# Altium schematic sheet MCUSTM32F4ZGT6.SchDoc
size A3
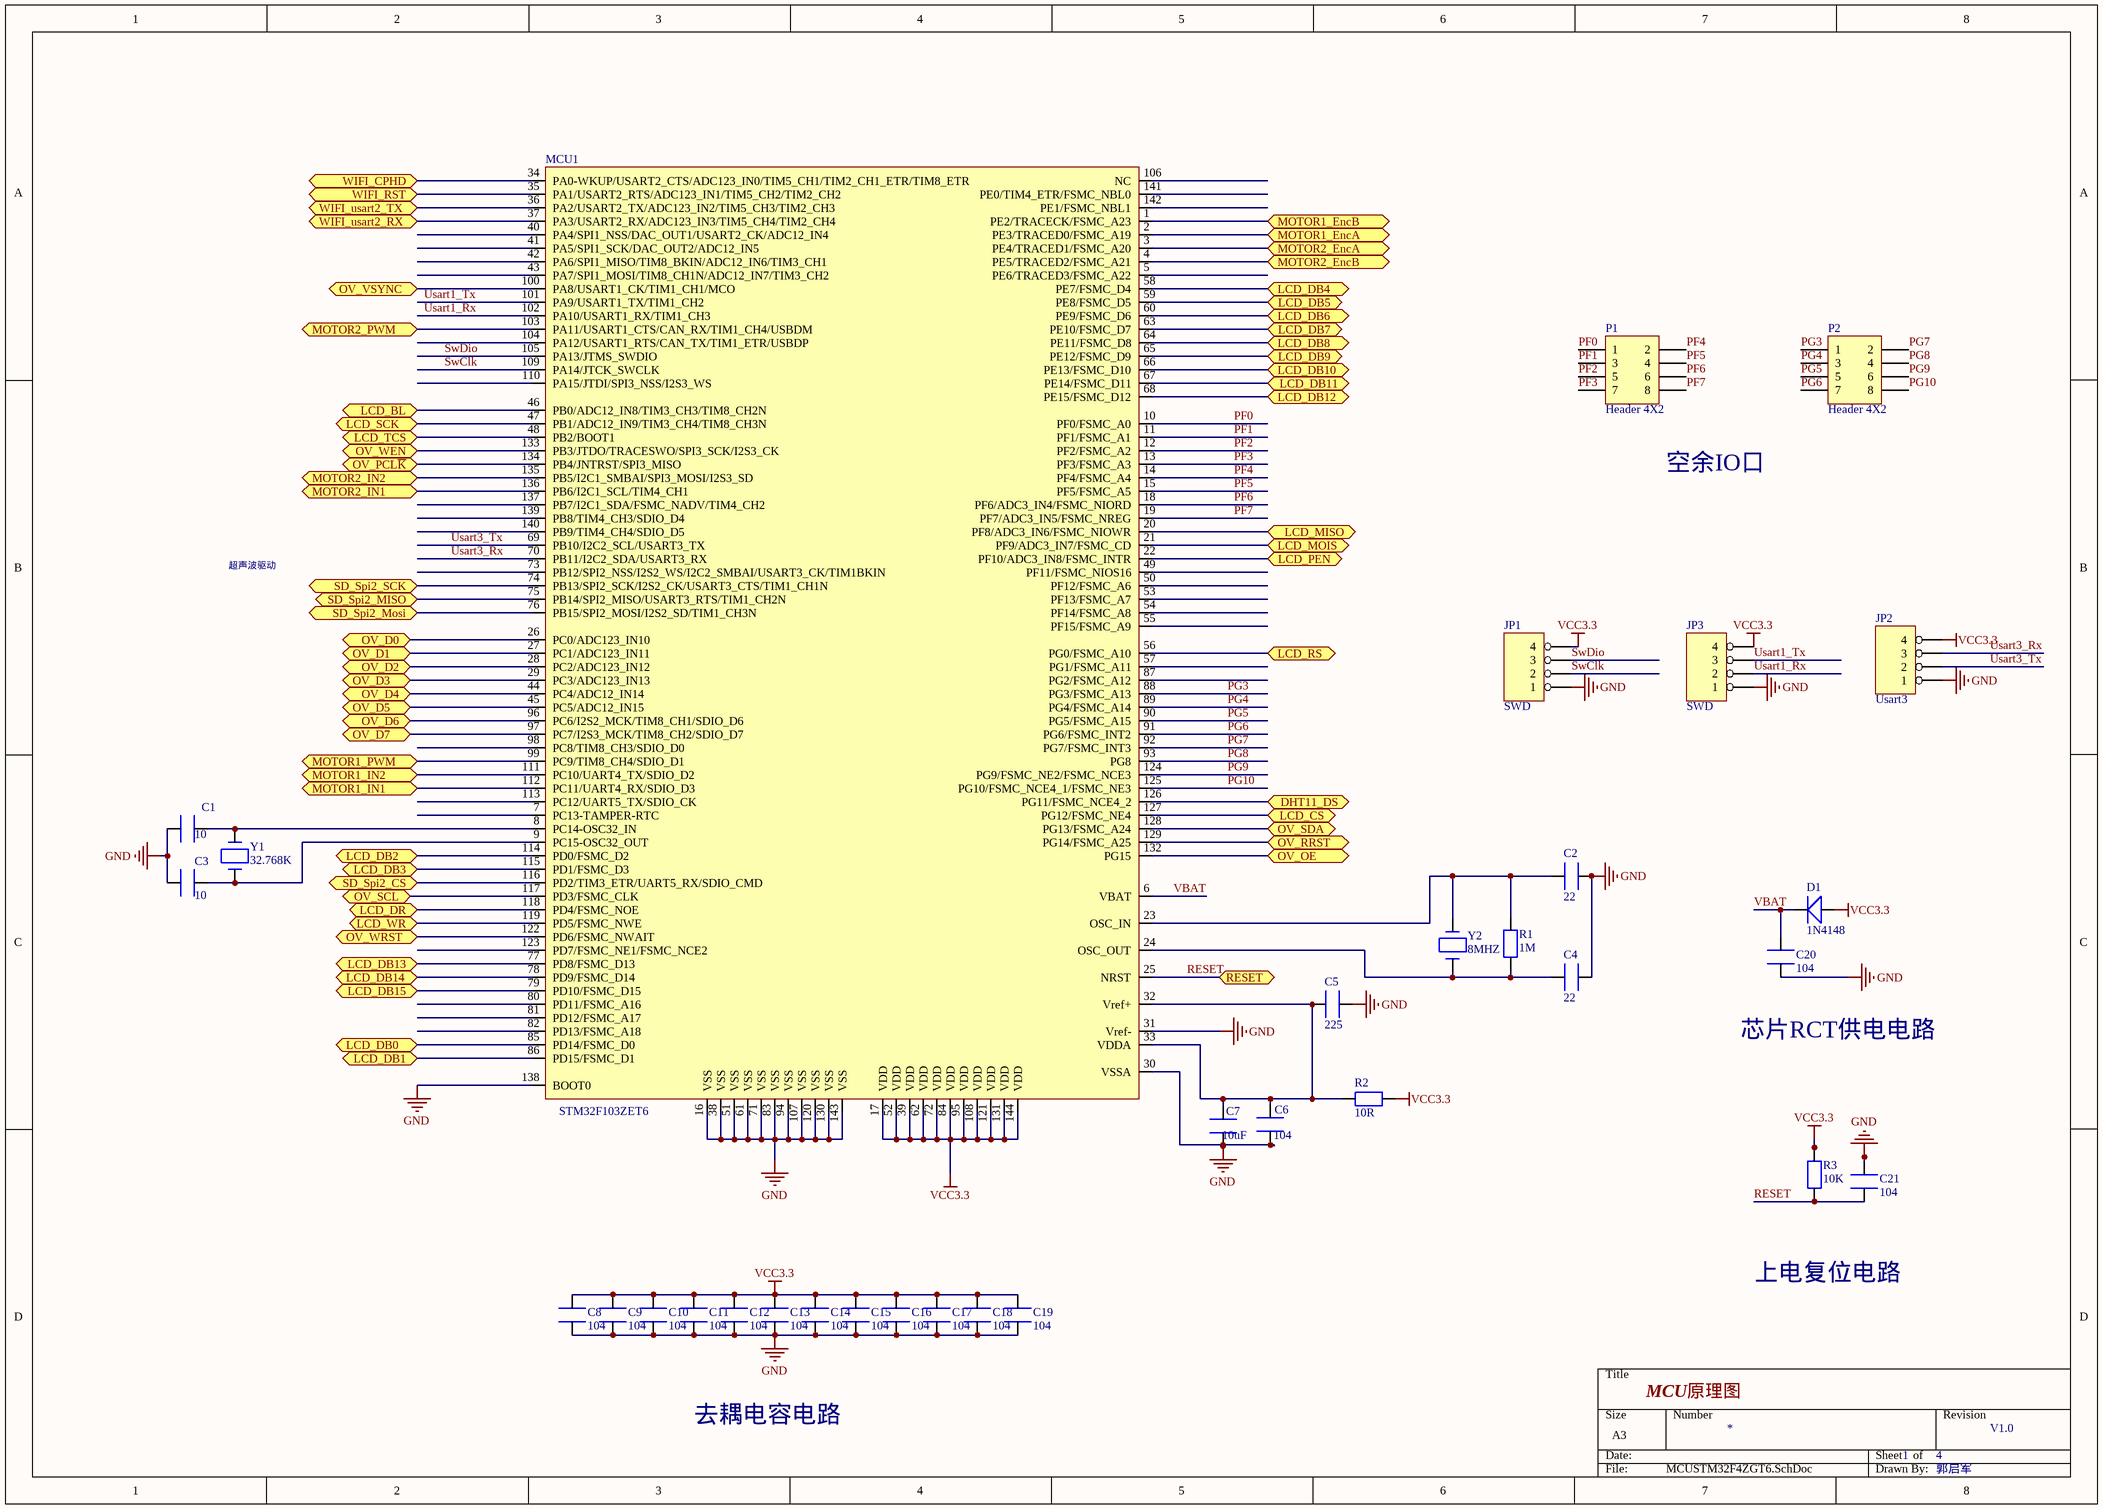
[diagram p0: MCUSTM32F4ZGT6.SchDoc]

## Parts
C1  10  [0805-bottom layer]
C2  22  [0805-bottom layer]
C3  10  [0805-bottom layer]
C4  22  [0805-bottom layer]
C5  225  [0805-bottom layer]
C6  104  [0805-bottom layer]
C7  10uF  [0805-bottom layer]
C8  104  [0805-bottom layer]
C9  104  [0805-bottom layer]
C10  104  [0805-bottom layer]
C11  104  [0805-bottom layer]
C12  104  [0805-bottom layer]
C13  104  [0805-bottom layer]
C14  104  [0805-bottom layer]
C15  104  [0805-bottom layer]
C16  104  [0805-bottom layer]
C17  104  [0805-bottom layer]
C18  104  [0805-bottom layer]
C19  104  [0805-bottom layer]
C20  104  [0805-bottom layer]
C21  104  [0805-bottom layer]
D1  1N4148  [DIODE_SOP]
JP1  SWD  [HDR1X4]
JP2  Usart3  [HDR1X4]
JP3  SWD  [HDR1X4]
MCU1  STM32F103ZET6  [LQFP144]
P1  Header 4X2  [HDR2X4]
P2  Header 4X2  [HDR2X4]
R1  1M  [0805-bottom layer]
R2  10R  [0805-bottom layer]
R3  10K  [0805-bottom layer]
Y1  32.768K  [XTAL32]
Y2  8MHZ  [XTAL_US]

## Ports
DHT11_DS, LCD_BL, LCD_CS, LCD_DB0, LCD_DB1, LCD_DB2, LCD_DB3, LCD_DB4, LCD_DB5, LCD_DB6, LCD_DB7, LCD_DB8, LCD_DB9, LCD_DB10, LCD_DB11, LCD_DB12, LCD_DB13, LCD_DB14, LCD_DB15, LCD_DR, LCD_MISO, LCD_MOIS, LCD_PEN, LCD_RS, LCD_SCK, LCD_TCS, LCD_WR, MOTOR1_EncA, MOTOR1_EncB, MOTOR1_IN1, MOTOR1_IN2, MOTOR1_PWM, MOTOR2_EncA, MOTOR2_EncB, MOTOR2_IN1, MOTOR2_IN2, MOTOR2_PWM, OV_D0, OV_D1, OV_D2, OV_D3, OV_D4, OV_D5, OV_D6, OV_D7, OV_OE, OV_PCL~{K}, OV_RRST, OV_SCL, OV_SDA, OV_VSYNC, OV_WEN, OV_WRST, RESET, SD_Spi2_CS, SD_Spi2_MISO, SD_Spi2_Mosi, SD_Spi2_SCK, WIFI_CPHD, WIFI_RST, WIFI_usart2_RX, WIFI_usart2_TX

## Nets
GND: C1.2 C2.1 C3.1 C4.1 C5.1 C6.2 C7.2 C8.2 C9.2 C10.2 C11.2 C12.2 C13.2 C14.2 C15.2 C16.2 C17.2 C18.2 C19.2 C20.1 C21.1 JP1.1 JP2.1 JP3.1 MCU1.16(VSS) MCU1.30(VSSA) MCU1.31(Vref-) MCU1.38(VSS) MCU1.51(VSS) MCU1.61(VSS) MCU1.71(VSS) MCU1.83(VSS) MCU1.94(VSS) MCU1.107(VSS) MCU1.120(VSS) MCU1.130(VSS) MCU1.138(BOOT0) MCU1.143(VSS)
VCC3.3: C8.1 C9.1 C10.1 C11.1 C12.1 C13.1 C14.1 C15.1 C16.1 C17.1 C18.1 C19.1 D1.1 JP1.4 JP2.4 JP3.4 MCU1.17(VDD) MCU1.39(VDD) MCU1.52(VDD) MCU1.62(VDD) MCU1.72(VDD) MCU1.84(VDD) MCU1.95(VDD) MCU1.108(VDD) MCU1.121(VDD) MCU1.131(VDD) MCU1.144(VDD) R2.2 R3.2
DHT11_DS: MCU1.126(PG11/FSMC_NCE4_2) ; port DHT11_DS
LCD_BL: MCU1.46(PB0/ADC12_IN8/TIM3_CH3/TIM8_CH2N) ; port LCD_BL
LCD_CS: MCU1.127(PG12/FSMC_NE4) ; port LCD_CS
LCD_DB0: MCU1.85(PD14/FSMC_D0) ; port LCD_DB0
LCD_DB1: MCU1.86(PD15/FSMC_D1) ; port LCD_DB1
LCD_DB2: MCU1.114(PD0/FSMC_D2) ; port LCD_DB2
LCD_DB3: MCU1.115(PD1/FSMC_D3) ; port LCD_DB3
LCD_DB4: MCU1.58(PE7/FSMC_D4) ; port LCD_DB4
LCD_DB5: MCU1.59(PE8/FSMC_D5) ; port LCD_DB5
LCD_DB6: MCU1.60(PE9/FSMC_D6) ; port LCD_DB6
LCD_DB7: MCU1.63(PE10/FSMC_D7) ; port LCD_DB7
LCD_DB8: MCU1.64(PE11/FSMC_D8) ; port LCD_DB8
LCD_DB9: MCU1.65(PE12/FSMC_D9) ; port LCD_DB9
LCD_DB10: MCU1.66(PE13/FSMC_D10) ; port LCD_DB10
LCD_DB11: MCU1.67(PE14/FSMC_D11) ; port LCD_DB11
LCD_DB12: MCU1.68(PE15/FSMC_D12) ; port LCD_DB12
LCD_DB13: MCU1.77(PD8/FSMC_D13) ; port LCD_DB13
LCD_DB14: MCU1.78(PD9/FSMC_D14) ; port LCD_DB14
LCD_DB15: MCU1.79(PD10/FSMC_D15) ; port LCD_DB15
LCD_DR: MCU1.118(PD4/FSMC_NOE) ; port LCD_DR
LCD_MISO: MCU1.20(PF8/ADC3_IN6/FSMC_NIOWR) ; port LCD_MISO
LCD_MOIS: MCU1.21(PF9/ADC3_IN7/FSMC_CD) ; port LCD_MOIS
LCD_PEN: MCU1.22(PF10/ADC3_IN8/FSMC_INTR) ; port LCD_PEN
LCD_RS: MCU1.56(PG0/FSMC_A10) ; port LCD_RS
LCD_SCK: MCU1.47(PB1/ADC12_IN9/TIM3_CH4/TIM8_CH3N) ; port LCD_SCK
LCD_TCS: MCU1.48(PB2/BOOT1) ; port LCD_TCS
LCD_WR: MCU1.119(PD5/FSMC_NWE) ; port LCD_WR
MOTOR1_EncA: MCU1.2(PE3/TRACED0/FSMC_A19) ; port MOTOR1_EncA
MOTOR1_EncB: MCU1.1(PE2/TRACECK/FSMC_A23) ; port MOTOR1_EncB
MOTOR1_IN1: MCU1.112(PC11/UART4_RX/SDIO_D3) ; port MOTOR1_IN1
MOTOR1_IN2: MCU1.111(PC10/UART4_TX/SDIO_D2) ; port MOTOR1_IN2
MOTOR1_PWM: MCU1.99(PC9/TIM8_CH4/SDIO_D1) ; port MOTOR1_PWM
MOTOR2_EncA: MCU1.3(PE4/TRACED1/FSMC_A20) ; port MOTOR2_EncA
MOTOR2_EncB: MCU1.4(PE5/TRACED2/FSMC_A21) ; port MOTOR2_EncB
MOTOR2_IN1: MCU1.136(PB6/I2C1_SCL/TIM4_CH1) ; port MOTOR2_IN1
MOTOR2_IN2: MCU1.135(PB5/I2C1_SMBAI/SPI3_MOSI/I2S3_SD) ; port MOTOR2_IN2
MOTOR2_PWM: MCU1.103(PA11/USART1_CTS/CAN_RX/TIM1_CH4/USBDM) ; port MOTOR2_PWM
OV_D0: MCU1.26(PC0/ADC123_IN10) ; port OV_D0
OV_D1: MCU1.27(PC1/ADC123_IN11) ; port OV_D1
OV_D2: MCU1.28(PC2/ADC123_IN12) ; port OV_D2
OV_D3: MCU1.29(PC3/ADC123_IN13) ; port OV_D3
OV_D4: MCU1.44(PC4/ADC12_IN14) ; port OV_D4
OV_D5: MCU1.45(PC5/ADC12_IN15) ; port OV_D5
OV_D6: MCU1.96(PC6/I2S2_MCK/TIM8_CH1/SDIO_D6) ; port OV_D6
OV_D7: MCU1.97(PC7/I2S3_MCK/TIM8_CH2/SDIO_D7) ; port OV_D7
OV_OE: MCU1.132(PG15) ; port OV_OE
OV_PCL~{K}: MCU1.134(PB4/JNTRST/SPI3_MISO) ; port OV_PCL~{K}
OV_RRST: MCU1.129(PG14/FSMC_A25) ; port OV_RRST
OV_SCL: MCU1.117(PD3/FSMC_CLK) ; port OV_SCL
OV_SDA: MCU1.128(PG13/FSMC_A24) ; port OV_SDA
OV_VSYNC: MCU1.100(PA8/USART1_CK/TIM1_CH1/MCO) ; port OV_VSYNC
OV_WEN: MCU1.133(PB3/JTDO/TRACESWO/SPI3_SCK/I2S3_CK) ; port OV_WEN
OV_WRST: MCU1.122(PD6/FSMC_NWAIT) ; port OV_WRST
PF0: MCU1.10(PF0/FSMC_A0) P1.1
PF1: MCU1.11(PF1/FSMC_A1) P1.3
PF2: MCU1.12(PF2/FSMC_A2) P1.5
PF3: MCU1.13(PF3/FSMC_A3) P1.7
PF4: MCU1.14(PF4/FSMC_A4) P1.2
PF5: MCU1.15(PF5/FSMC_A5) P1.4
PF6: MCU1.18(PF6/ADC3_IN4/FSMC_NIORD) P1.6
PF7: MCU1.19(PF7/ADC3_IN5/FSMC_NREG) P1.8
PG3: MCU1.88(PG3/FSMC_A13) P2.1
PG4: MCU1.89(PG4/FSMC_A14) P2.3
PG5: MCU1.90(PG5/FSMC_A15) P2.5
PG6: MCU1.91(PG6/FSMC_INT2) P2.7
PG7: MCU1.92(PG7/FSMC_INT3) P2.2
PG8: MCU1.93(PG8) P2.4
PG9: MCU1.124(PG9/FSMC_NE2/FSMC_NCE3) P2.6
PG10: MCU1.125(PG10/FSMC_NCE4_1/FSMC_NE3) P2.8
RESET: C21.2 MCU1.25(NRST) R3.1 ; port RESET
SD_Spi2_CS: MCU1.116(PD2/TIM3_ETR/UART5_RX/SDIO_CMD) ; port SD_Spi2_CS
SD_Spi2_MISO: MCU1.75(PB14/SPI2_MISO/USART3_RTS/TIM1_CH2N) ; port SD_Spi2_MISO
SD_Spi2_Mosi: MCU1.76(PB15/SPI2_MOSI/I2S2_SD/TIM1_CH3N) ; port SD_Spi2_Mosi
SD_Spi2_SCK: MCU1.74(PB13/SPI2_SCK/I2S2_CK/USART3_CTS/TIM1_CH1N) ; port SD_Spi2_SCK
SwClk: JP1.2 MCU1.109(PA14/JTCK_SWCLK)
SwDio: JP1.3 MCU1.105(PA13/JTMS_SWDIO)
Usart1_Rx: JP3.2 MCU1.102(PA10/USART1_RX/TIM1_CH3)
Usart1_Tx: JP3.3 MCU1.101(PA9/USART1_TX/TIM1_CH2)
Usart3_Rx: JP2.3 MCU1.70(PB11/I2C2_SDA/USART3_RX)
Usart3_Tx: JP2.2 MCU1.69(PB10/I2C2_SCL/USART3_TX)
VBAT: C20.2 D1.2 MCU1.6(VBAT)
WIFI_CPHD: MCU1.34(PA0-WKUP/USART2_CTS/ADC123_IN0/TIM5_CH1/TIM2_CH1_ETR/TIM8_ETR) ; port WIFI_CPHD
WIFI_RST: MCU1.35(PA1/USART2_RTS/ADC123_IN1/TIM5_CH2/TIM2_CH2) ; port WIFI_RST
WIFI_usart2_RX: MCU1.37(PA3/USART2_RX/ADC123_IN3/TIM5_CH4/TIM2_CH4) ; port WIFI_usart2_RX
WIFI_usart2_TX: MCU1.36(PA2/USART2_TX/ADC123_IN2/TIM5_CH3/TIM2_CH3) ; port WIFI_usart2_TX
NetC1_1: C1.1 MCU1.8(PC14-OSC32_IN) Y1.2
NetC2_2: C2.2 MCU1.23(OSC_IN) R1.2 Y2.1
NetC3_2: C3.2 MCU1.9(PC15-OSC32_OUT) Y1.1
NetC4_2: C4.2 MCU1.24(OSC_OUT) R1.1 Y2.2
NetC5_2: C5.2 C6.1 C7.1 MCU1.32(Vref+) MCU1.33(VDDA) R2.1

Not connected (* = marked no-connect by the designer): MCU1 5(PE6/TRACED3/FSMC_A22) 7(PC13-TAMPER-RTC) 40(PA4/SPI1_NSS/DAC_OUT1/USART2_CK/ADC12_IN4) 41(PA5/SPI1_SCK/DAC_OUT2/ADC12_IN5) 42(PA6/SPI1_MISO/TIM8_BKIN/ADC12_IN6/TIM3_CH1) 43(PA7/SPI1_MOSI/TIM8_CH1N/ADC12_IN7/TIM3_CH2) 49(PF11/FSMC_NIOS16) 50(PF12/FSMC_A6) 53(PF13/FSMC_A7) 54(PF14/FSMC_A8) 55(PF15/FSMC_A9) 57(PG1/FSMC_A11) 73(PB12/SPI2_NSS/I2S2_WS/I2C2_SMBAI/USART3_CK/TIM1BKIN) 80(PD11/FSMC_A16) 81(PD12/FSMC_A17) 82(PD13/FSMC_A18) 87(PG2/FSMC_A12) 98(PC8/TIM8_CH3/SDIO_D0) 104(PA12/USART1_RTS/CAN_TX/TIM1_ETR/USBDP) 106(NC) 110(PA15/JTDI/SPI3_NSS/I2S3_WS) 113(PC12/UART5_TX/SDIO_CK) 123(PD7/FSMC_NE1/FSMC_NCE2) 137(PB7/I2C1_SDA/FSMC_NADV/TIM4_CH2) 139(PB8/TIM4_CH3/SDIO_D4) 140(PB9/TIM4_CH4/SDIO_D5) 141(PE0/TIM4_ETR/FSMC_NBL0) 142(PE1/FSMC_NBL1)

## Notes on the sheet
- 空余IO口
- 超声波驱动
- 芯片RCT供电电路
- 上电复位电路
- MCU原理图
- 去耦电容电路
- *
- 1
- 4
- V1.0
- 郭启军

## Library data of the parts
C1 C3 = 10: 电容
C2 C4 = 22: 电容
C5 = 225: 电容
C6 C8-C21 = 104: 电容
C7 = 10uF: 电容
D1 = 1N4148: 限流二极管
JP1-JP3 = HEADER 4
P1 P2 = Header 4X2: Header, 4-Pin, Dual row; LatestRevisionDate: 17-Jul-2002; LatestRevisionNote: Re-released for DXP Platform.; Publisher: Altium Limited
R1 = 1M: 电阻
R2 = 10R: 电阻
R3 = 10K: 电阻
Y1 = 32.768K: 晶振
Y2 = 8MHZ: 晶振